# Altium schematic sheet v1.0.SchDoc
size 106 x 35 mm
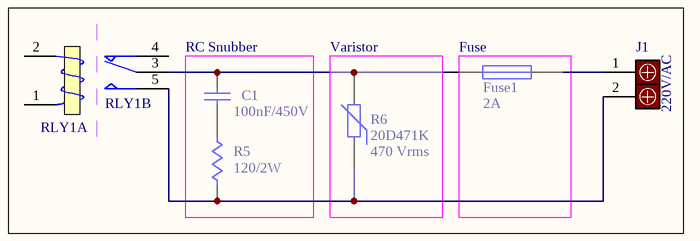
[diagram p0: v1.0.SchDoc]

## Parts
C1  100nF/450V  [C_THD_CER_(P2.54-D3.5-T1.5)]
Fuse1  2A  [PIN-W2/E2.8]
J1  2PIN  [Connector_Phoenix_2PIN_MSTB]  (value not drawn)
R5  120/2W  [R_THD_AXIAL0.9(3W)]
R6  20D471K  Text: 470 Vrms
RLY1  12V  [RELAY_SPDT_5PIN_2216]  (value not drawn)  (parts A,B of 2)

## Blocks framed on the sheet
RC Snubber: C1 R5
Varistor: R6
Fuse: Fuse1

## Nets
NetC1_1: C1.1 R5.2
NetC1_2: C1.2 Fuse1.1 R6.2 RLY1.3(COM)
NetFuse1_2: Fuse1.2 J1.1
NetJ1_2: J1.2 R5.1 R6.1 RLY1.5(NO)

Not connected (* = marked no-connect by the designer): RLY1 1(T2) 2(T1) 4(NC)

## Notes on the sheet
- (near J1) 220V/AC

## Library data of the parts
C1 = Capacitor_Ceramic: Capacitor, Ceramic Multilayer; Revision: July-2002: Re-released for DXP Platform.
Fuse1 = Fuse 1: Fuse; Manufacturer: Generic Components; Class I: Passive; Published: 8-Jun-2000; Revision: July-2002: Re-released for DXP Platform.; Publisher: Altium Limited; Class II: Fuse
J1 = Connector1x2_Power: Connector, Header, 2Pin; Revision: July-2002: Re-released for DXP Platform.
R5 = Resistor_3Form: Resistor; Revision: July-2002: Re-released for DXP Platform.
R6 = Res Varistor: Varistor; Manufacturer: Generic Components; Class I: Discrete; Class II: Voltage-Sensitive Resistor; Published: 24-Mar-1999; Revision: July-2002: Re-released for DXP Platform.; Publisher: Altium Limited
RLY1 = Relay_SPDT_2Form: SPDT Relay